# Altium schematic sheet TOP.SchDoc
size A4; SheetNumber: 1; SheetTotal: 5
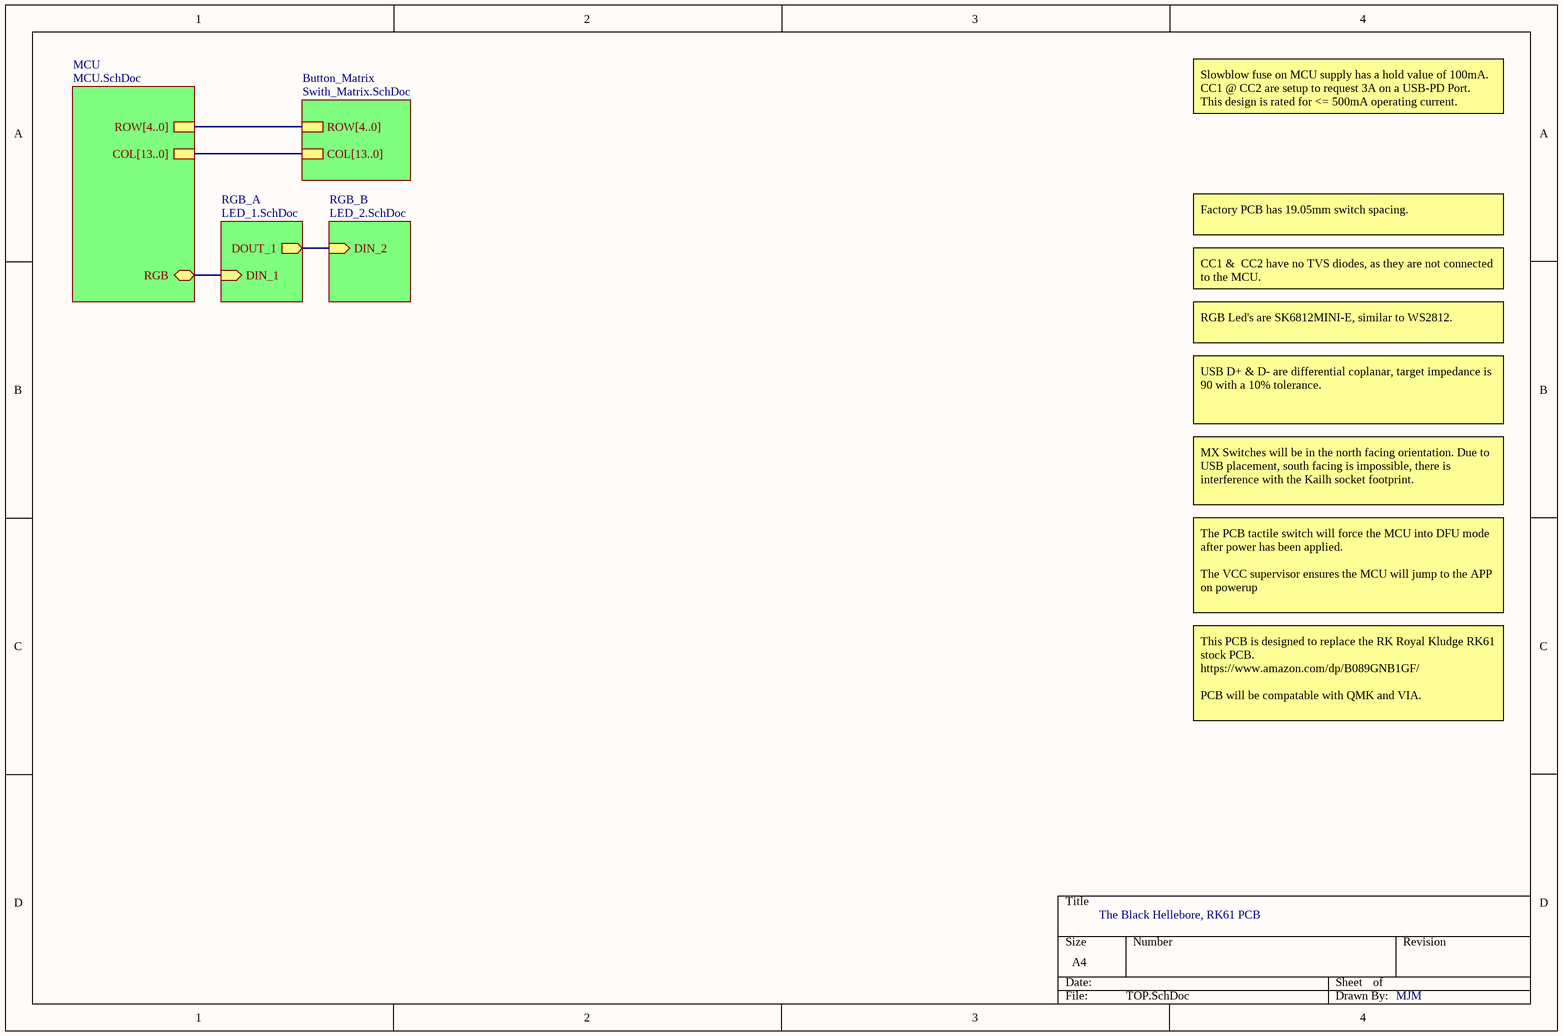
[diagram p0: TOP.SchDoc]

## Sub-sheets
Button_Matrix = Swith_Matrix.SchDoc: ROW[4..0], COL[13..0]
MCU = MCU.SchDoc: ROW[4..0], COL[13..0], RGB (bidir)
RGB_A = LED_1.SchDoc: DIN_1 (in), DOUT_1 (out)
RGB_B = LED_2.SchDoc: DIN_2 (in)

## Nets
(unnamed): sheet RGB_A/DIN_1, sheet MCU/RGB
(unnamed): sheet RGB_A/DOUT_1, sheet RGB_B/DIN_2

## Buses and harness runs
bus sheet Button_Matrix/COL[13..0] = sheet MCU/COL[13..0]
bus sheet Button_Matrix/ROW[4..0] = sheet MCU/ROW[4..0]

## Notes on the sheet
- Slowblow fuse on MCU supply has a hold value of 100mA.
  CC1 @ CC2 are setup to request 3A on a USB-PD Port.
  This design is rated for <= 500mA operating current.
- Factory PCB has 19.05mm switch spacing.
- CC1 &  CC2 have no TVS diodes, as they are not connected to the MCU.
- RGB Led's are SK6812MINI-E, similar to WS2812.
- USB D+ & D- are differential coplanar, target impedance is 90 with a 10% tolerance.
- MX Switches will be in the north facing orientation. Due to USB placement, south facing is impossible, there is interference with the Kailh socket footprint.
- The PCB tactile switch will force the MCU into DFU mode after power has been applied.
  The VCC supervisor ensures the MCU will jump to the APP on powerup
- This PCB is designed to replace the RK Royal Kludge RK61 stock PCB.
  https://www.amazon.com/dp/B089GNB1GF/
  PCB will be compatable with QMK and VIA.
- The Black Hellebore, RK61 PCB
- MJM